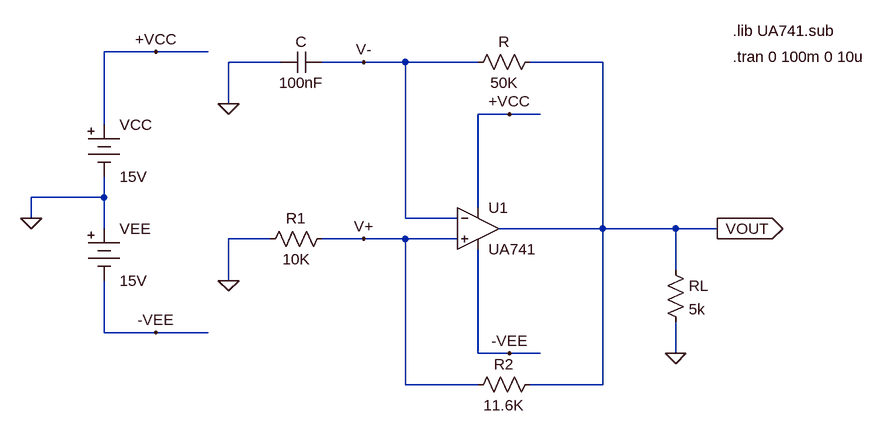
[diagram p0: schematic lab1-1.asc]
lab1-1.asc, the LTspice schematic file:
Version 4
SHEET 1 964 724
WIRE -160 -96 -240 -96
WIRE -80 -96 -160 -96
WIRE 32 -80 -48 -80
WIRE 160 -80 96 -80
WIRE 224 -80 160 -80
WIRE 336 -80 224 -80
WIRE 528 -80 416 -80
WIRE -48 -16 -48 -80
WIRE 384 0 336 0
WIRE 432 0 384 0
WIRE -240 16 -240 -96
WIRE -240 128 -240 96
WIRE -240 128 -352 128
WIRE 336 144 336 0
WIRE -352 160 -352 128
WIRE 224 160 224 -80
WIRE 304 160 224 160
WIRE -240 176 -240 128
WIRE 528 176 528 -80
WIRE 528 176 368 176
WIRE 640 176 528 176
WIRE 704 176 640 176
WIRE 16 192 -48 192
WIRE 160 192 96 192
WIRE 224 192 160 192
WIRE 304 192 224 192
WIRE 640 240 640 176
WIRE -48 256 -48 192
WIRE -240 336 -240 256
WIRE -160 336 -240 336
WIRE -80 336 -160 336
WIRE 336 368 336 208
WIRE 384 368 336 368
WIRE 432 368 384 368
WIRE 640 368 640 320
WIRE 224 416 224 192
WIRE 336 416 224 416
WIRE 528 416 528 176
WIRE 528 416 416 416
FLAG 704 176 VOUT
IOPIN 704 176 Out
FLAG -352 160 0
FLAG -160 -96 +VCC
FLAG 384 0 +VCC
FLAG -160 336 -VEE
FLAG 384 368 -VEE
FLAG 640 368 0
FLAG -48 -16 0
FLAG -48 256 0
FLAG 160 -80 V-
FLAG 160 192 V+
SYMBOL Opamps\\opamp2 336 112 R0
SYMATTR InstName U1
SYMATTR Value UA741
SYMBOL res 624 224 R0
SYMATTR InstName RL
SYMATTR Value 5k
SYMBOL Misc\\battery -240 0 R0
SYMATTR InstName VCC
SYMATTR Value 15V
SYMBOL Misc\\battery -240 160 R0
SYMATTR InstName VEE
SYMATTR Value 15V
SYMBOL res 432 -96 R90
WINDOW 0 0 56 VBottom 2
WINDOW 3 32 56 VTop 2
SYMATTR InstName R
SYMATTR Value 50K
SYMBOL cap 96 -96 R90
WINDOW 0 0 32 VBottom 2
WINDOW 3 32 32 VTop 2
SYMATTR InstName C
SYMATTR Value 100nF
SYMBOL res 112 176 R90
WINDOW 0 0 56 VBottom 2
WINDOW 3 32 56 VTop 2
SYMATTR InstName R1
SYMATTR Value 10K
SYMBOL res 432 400 R90
WINDOW 0 0 56 VBottom 2
WINDOW 3 32 56 VTop 2
SYMATTR InstName R2
SYMATTR Value 11.6K
TEXT 728 -128 Left 2 !.lib UA741.sub
TEXT 728 -88 Left 2 !.tran 0 100m 0 10u

The netlist it stands for:
* lab1-1.asc
XU1 V+ V- +VCC -VEE VOUT UA741  ; pins In+ In- V+ V- OUT
RL VOUT 0 5k
VCC +VCC 0 15V
VEE 0 -VEE 15V
R VOUT V- 50K
C V- 0 100nF
R1 V+ 0 10K
R2 VOUT V+ 11.6K
.lib UA741.sub
.tran 0 100m 0 10u
.backanno
.end

* Results of the author's LTspice run, read from the files saved beside the schematic
* Operating Point, zero values left out:
*   V(vout) = 6.649 mV
*   V(-vee) = -15 V
*   V(+vcc) = 15 V
*   V(v-) = 2.661 mV
*   V(v+) = 2.65 mV
*   I(R2) = 344.7 nA
*   I(R1) = 265 nA
*   I(R) = 79.76 nA
*   I(Rl) = 1.33 µA
*   I(Vee) = -1.667 mA
*   I(Vcc) = -1.667 mA
*   Ix(u1:1) = 79.74 nA
*   Ix(u1:2) = 79.76 nA
*   Ix(u1:3) = 1.667 mA
*   Ix(u1:4) = -1.667 mA
*   Ix(u1:5) = -1.754 µA
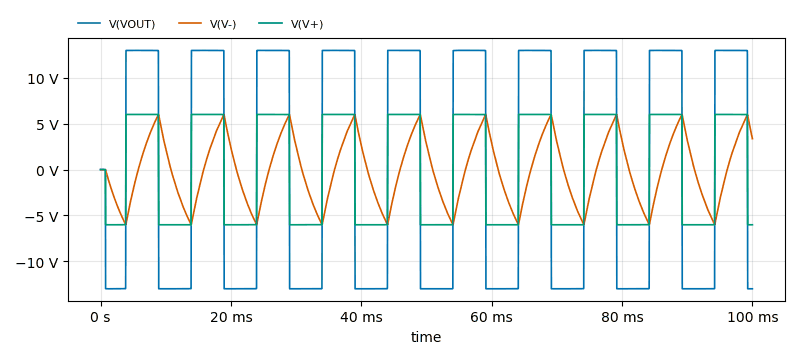
[diagram p1: Transient Analysis of lab1-1.asc, plotted from the saved traces]
* Transient Analysis, 1 run:
*   V(VOUT): min -13.01 V, max 13.01 V, average 153.3 mV, rms 12.92 V, last -13.01 V
*   V(V-): min -6.005 V, max 6.004 V, average -20.34 mV, rms 3.654 V, last 3.371 V
*   V(V+): min -6.022 V, max 6.023 V, average 70.5 mV, rms 5.979 V, last -6.021 V